# Altium project DC_CDI_Honda_CX500_rev2.2.PrjPcb
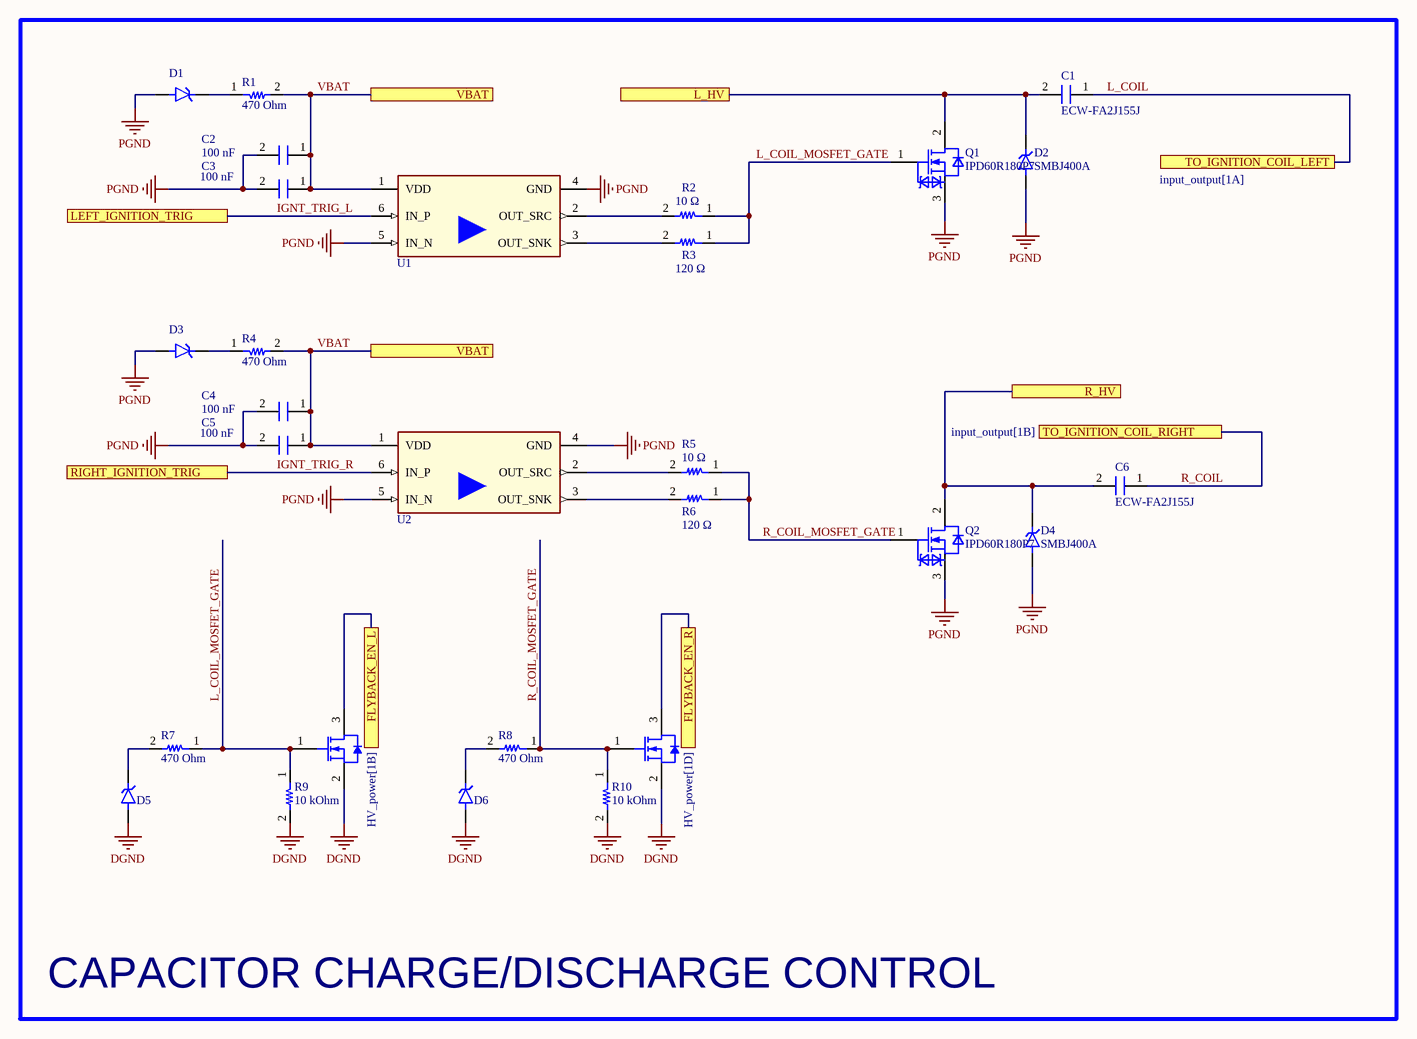
[diagram p0: cd_switching.SchDoc]
4 sheets, 131 parts. Net scope: flat (ports and power ports of the same name join across sheets).
Board file: dc_cdi_cx500.PcbDoc
Sheets:
  cd_switching.SchDoc
  input_output.SchDoc
  logic.SchDoc
  HV_power.SchDoc

## Sheet cd_switching.SchDoc: Power Side
size A3; SheetNumber: 1; SheetTotal: 6

### Parts
C1  ECW-FA2J155J  [22,5mm_CAP]
C2  value 100 nF  [0603_FP]  (hidden comment: Capacitor_0603)
C3  value 100 nF  [0603_FP]  (hidden comment: Capacitor_0603)
C4  value 100 nF  [0603_FP]  (hidden comment: Capacitor_0603)
C5  value 100 nF  [0603_FP]  (hidden comment: Capacitor_0603)
C6  ECW-FA2J155J  [22,5mm_CAP]
D1  BZT52B15SH_RRG  [DIO_BZT52B15SH_RRG]  (value not drawn)
D2  SMBJ400A  [DIOM5436X261N]
D3  BZT52B15SH_RRG  [DIO_BZT52B15SH_RRG]  (value not drawn)
D4  SMBJ400A  [DIOM5436X261N]
D5  BZT52B15SH_RRG  [DIO_BZT52B15SH_RRG]  (value not drawn)
D6  BZT52B15SH_RRG  [DIO_BZT52B15SH_RRG]  (value not drawn)
Q1  IPD60R180P7  [DPAK228P987X240-3N]
Q2  IPD60R180P7  [DPAK228P987X240-3N]
Q3  MGSF1N03LT1G  [ONSC-SOT-23-3-318-08_V]  (value not drawn)
Q4  MGSF1N03LT1G  [ONSC-SOT-23-3-318-08_V]  (value not drawn)
R1  value 470 Ohm  [0603_FP]  (hidden comment: Resistor_0603)
R2  value 10 Ω  [0603_FP]  (hidden comment: Resistor_0603)
R3  value 120 Ω  [0603_FP]  (hidden comment: Resistor_0603)
R4  value 470 Ohm  [0603_FP]  (hidden comment: Resistor_0603)
R5  value 10 Ω  [0603_FP]  (hidden comment: Resistor_0603)
R6  value 120 Ω  [0603_FP]  (hidden comment: Resistor_0603)
R7  value 470 Ohm  [0603_FP]  (hidden comment: Resistor_0603)
R8  value 470 Ohm  [0603_FP]  (hidden comment: Resistor_0603)
R9  value 10 kOhm  [0402_fp]  (hidden comment: Resistor_0402)
R10  value 10 kOhm  [0402_fp]  (hidden comment: Resistor_0402)
U1  1EDN7511B  [SOT95P280X145-6N-7-V]  (value not drawn)
U2  1EDN7511B  [SOT95P280X145-6N-7-V]  (value not drawn)

### Blocks framed on the sheet
CAPACITOR CHARGE/DISCHARGE CONTROL: C1-C6 D1-D6 Q1-Q4 R1-R10 U1 U2

### Ports
FLYBACK_EN_L (see HV_power[1B]), FLYBACK_EN_R (see HV_power[1D]), L_HV (see HV_power[4A]), LEFT_IGNITION_TRIG (see logic[1A]), R_HV (see HV_power[4B]), RIGHT_IGNITION_TRIG (see logic[1B]), TO_IGNITION_COIL_LEFT (see input_output[1A]), TO_IGNITION_COIL_RIGHT (see input_output[1B]), VBAT (see cd_switching[3A], HV_power[1A], HV_power[1C], input_output[2D], LV_power[1B]), VBAT (see cd_switching[3B], HV_power[1A], HV_power[1C], input_output[2D], LV_power[1B])

### Nets
DGND: D5.2(A) D6.2(A) Q3.2(S) Q4.2(S) R9.2 R10.2
PGND: C2.2 C3.2 C4.2 C5.2 D1.2(A) D2.2(A) D3.2(A) D4.2(A) Q1.3(SOURCE) Q2.3(SOURCE) U1.4(GND) U1.5(IN_N) U2.4(GND) U2.5(IN_N)
FLYBACK_EN_L: Q3.3(D) ; port FLYBACK_EN_L
FLYBACK_EN_R: Q4.3(D) ; port FLYBACK_EN_R
IGNT_TRIG_L: U1.6(IN_P) ; port LEFT_IGNITION_TRIG
IGNT_TRIG_R: U2.6(IN_P) ; port RIGHT_IGNITION_TRIG
L_COIL: C1.1 ; port TO_IGNITION_COIL_LEFT
L_COIL_MOSFET_GATE: Q1.1(GATE) Q3.1(G) R2.1 R3.1 R7.1 R9.1
L_HV: C1.2 D2.1(K) Q1.2(DRAIN) ; port L_HV
R_COIL: C6.1 ; port TO_IGNITION_COIL_RIGHT
R_COIL_MOSFET_GATE: Q2.1(GATE) Q4.1(G) R5.1 R6.1 R8.1 R10.1
R_HV: C6.2 D4.1(K) Q2.2(DRAIN) ; port R_HV
VBAT: C2.1 C3.1 C4.1 C5.1 R1.2 R4.2 U1.1(VDD) U2.1(VDD) ; port VBAT
NetD1_1: D1.1(K) R1.1
NetD3_1: D3.1(K) R4.1
NetD5_1: D5.1(K) R7.2
NetD6_1: D6.1(K) R8.2
NetR2_2: R2.2 U1.2(OUT_SRC)
NetR3_2: R3.2 U1.3(OUT_SNK)
NetR5_2: R5.2 U2.2(OUT_SRC)
NetR6_2: R6.2 U2.3(OUT_SNK)

### Library data of the parts
C1 C6 = Capacitor_THT_22.5mm
C2-C5 = Capacitor_0603: Format: 0402; Package: 0402
D1 D3 D5 D6 = BZT52B15SH_RRG: SOD-323, 200mW, 2%, 15V, Zener Diode; MF: Taiwan Semiconductor Corporation; MP: BZT52B15SH RRG; SnapEDA_Link: https://www.snapeda.com/parts/BZT52B15SH%20RRG/Taiwan+Semiconductor+Corporation/view-part/?ref=snap; Package: SOD-323-2 Taiwan Semiconductor; Value: *; Check_prices: https://www.snapeda.com/parts/BZT52B15SH%20RRG/Taiwan+Semiconductor+Corporation/view-part/?ref=eda
D2 D4 = SMBJ400A: Pince 648V 900mA Ipp TVS Diode Surface Mount DO-214AA (SMBJ); MF: Littelfuse; SnapEDA_Link: https://www.snapeda.com/parts/SMBJ400A/Littelfuse/view-part/?ref=snap; Package: DO-214 Littelfuse; Value: *; MP: SMBJ400A; Check_prices: https://www.snapeda.com/parts/SMBJ400A/Littelfuse/view-part/?ref=eda
Q1 Q2 = IPD60R180P7: Insulated-Gate Field-Effect Transistor (IGFET), N-Channel, Enhancement, Body Diode, ESD Diode Gate/Source, Pin 1 Gate, 2 Drain, 3 Source, 3 Pins; Manufacturer: Infineon Technologies; PackageReference: PG-TO252-3-342; Manufacturer Order Number: IPD60R180P7
Q3 Q4 = CMP-1058-00778-1: Power MOSFET, 30 V, 2.1 A, Single N-Channel, 3-Pin SOT-23, Pb-Free, Tape and Reel; Manufacturer: On Semiconductor; VGS(th) Max (V): 2.4; Channel Polarity: N Channel; Ciss Typ (pF): 140; Crss Typ (pF): 40; Coss Typ (pF): 100; V(BR)DSS Min (V): 30; ID Max (A): 2.1; VGS Max (V): 20; ComponentLink1Description: Manufacturer URL; PartNumber: MGSF1N03LT1G; Packing: Tape and Reel; DatasheetVersion: Rev. 10; ComponentLink1URL: http://www.onsemi.com/; Mounting Technology: Surface Mount; PackageVersion: Rev. AP, 11/2009; PackageDescription: 3-Pin Small Outline Transistor, Body 2.92 x 1.3 mm, Pitch 0.95 mm; Package Type: SOT-23-3; ComponentLink3URL: http://www.onsemi.cn/pub_link/Collateral/318-08.PDF; RoHS: Pb-Free; ComponentLink3Description: Package Specification; ComponentLink2Description: Datasheet; Configuration: Single; PackageReference: SOT-23-3-318-08; ComponentLink2URL: http://www.onsemi.cn/pub_link/Collateral/MGSF1N03LT1-D.PDF
R1-R8 = Resistor_0603: Format: 0402; Package: 0402
R9 R10 = Resistor_0402: Format: 0402; Package: 0402
U1 U2 = 1EDN7511B: EiceDRIVER, Fast Single Channel 4A/8A Low-Side Gate Driver, UVLO - 4.2V; Manufacturer: Infineon Technologies; ManufacturerPartNumber: 1EDN7511B; PackageReference: PG-SOT23-6-2

## Sheet input_output.SchDoc
size A4; SheetNumber: 2; SheetTotal: 6
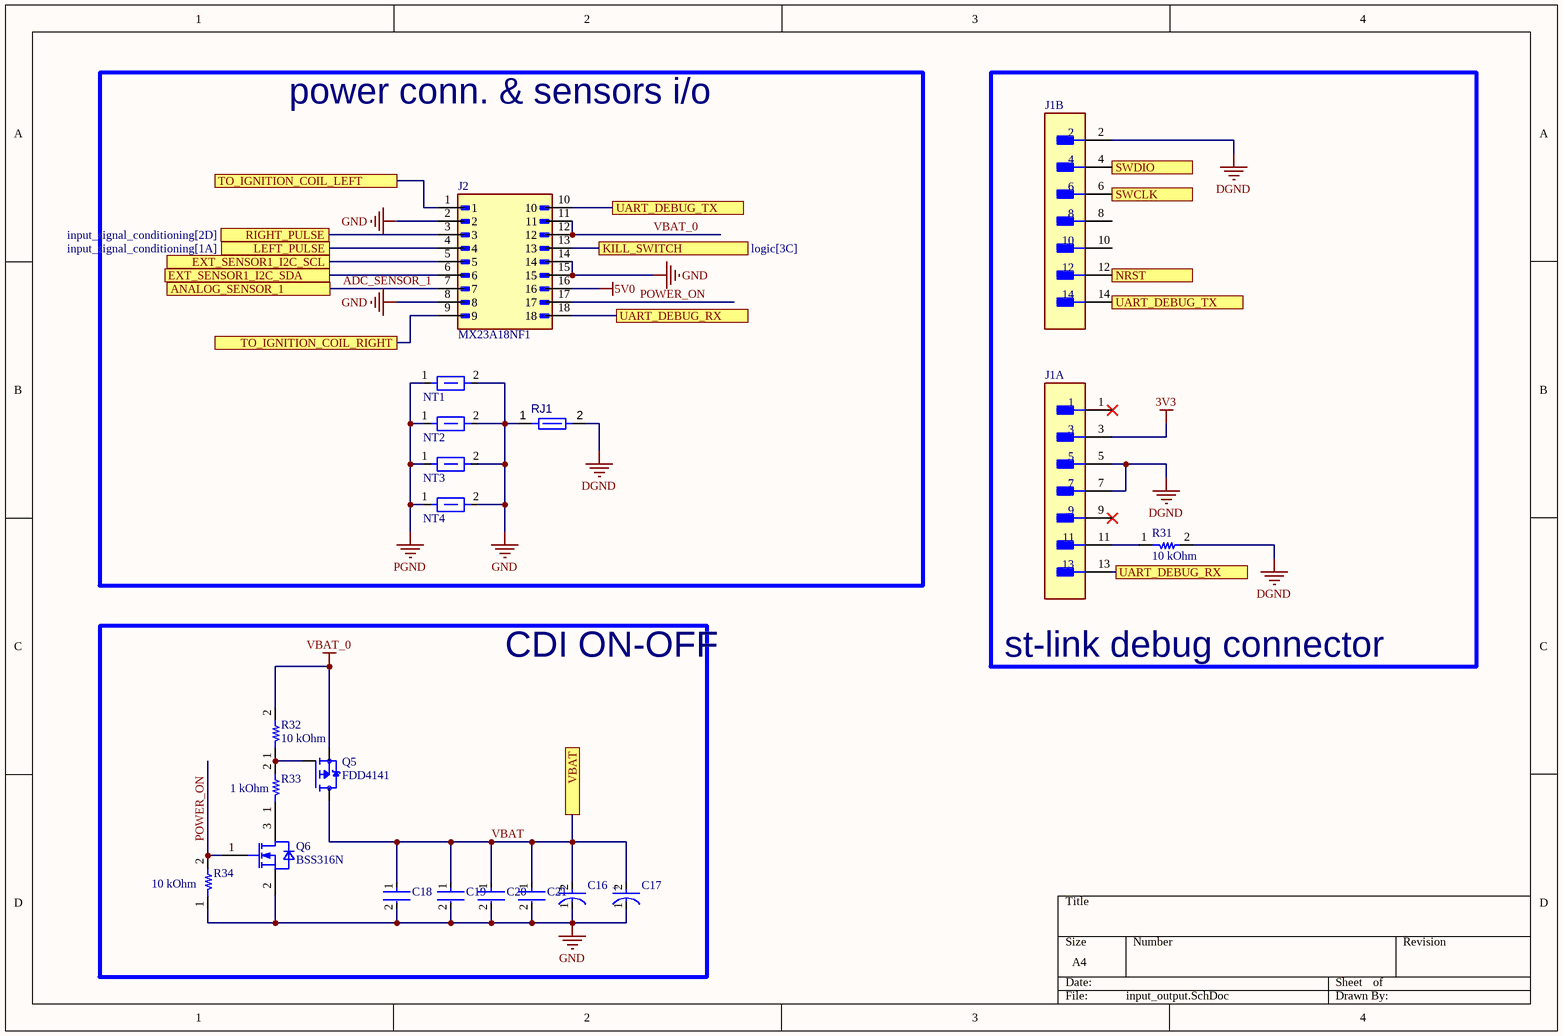
[diagram p1: input_output.SchDoc]

### Parts
C16  EEHZT1E221P  [FP-EEH-F-MFG]  (value not drawn)
C17  EEHZT1E221P  [FP-EEH-F-MFG]  (value not drawn)
C18  C1206X104J3GACTU  [FP-C1206X104J3GACTU-MFG]  (value not drawn)
C19  C1206X104J3GACTU  [FP-C1206X104J3GACTU-MFG]  (value not drawn)
C20  C1206X104J3GACTU  [FP-C1206X104J3GACTU-MFG]  (value not drawn)
C21  C1206X104J3GACTU  [FP-C1206X104J3GACTU-MFG]  (value not drawn)
J1  FTSH-107-01-F-DV-K  [FP-FTSH-107-01-F-DV-K-MFG]  (value not drawn)  (parts A,B of 2)
J2  MX23A18NF1  [JAE_MX23A18NF1]
NT1  GROUND_NET_TIE  [NET_TIE_GND]  (value not drawn)  (net tie, no BOM)
NT2  GROUND_NET_TIE  [NET_TIE_GND]  (value not drawn)  (net tie, no BOM)
NT3  GROUND_NET_TIE  [NET_TIE_GND]  (value not drawn)  (net tie, no BOM)
NT4  GROUND_NET_TIE  [NET_TIE_GND]  (value not drawn)  (net tie, no BOM)
Q5  FDD4141  [TO252]
Q6  BSS316N  [SOT95P260X110-3N]
R31  value 10 kOhm  [0603_FP]  (hidden comment: Resistor_0603)
R32  value 10 kOhm  [0603_FP]  (hidden comment: Resistor_0603)
R33  value 1 kOhm  [0603_FP]  (hidden comment: Resistor_0603)
R34  value 10 kOhm  [0603_FP]  (hidden comment: Resistor_0603)
RJ1  Net Tie 12x8mil  [SHORT06-FP]  (value not drawn)  (net tie, no BOM)

### Blocks framed on the sheet
power conn. & sensors i/o: J2 NT1-NT4 RJ1
st-link debug connector: J1 R31
CDI ON-OFF: C16-C21 Q5 Q6 R32-R34

### Ports
ANALOG_SENSOR_1 (see logic[1A]), EXT_SENSOR1_I2C_SCL (see logic[3A]), EXT_SENSOR1_I2C_SDA (see logic[3A]), KILL_SWITCH (see logic[3C]), LEFT_PULSE (see input_signal_conditioning[1A]), NRST (see logic[3B]), RIGHT_PULSE (see input_signal_conditioning[2D]), SWCLK (see logic[1B]), SWDIO (see logic[1B]), TO_IGNITION_COIL_LEFT (see cd_switching[6B]), TO_IGNITION_COIL_RIGHT (see cd_switching[6B]), UART_DEBUG_RX (see input_output[2B], logic[1B]), UART_DEBUG_RX (see input_output[3C], logic[1B]), UART_DEBUG_TX (see input_output[2A], logic[1B]), UART_DEBUG_TX (see input_output[3B], logic[1B]), VBAT (see cd_switching[3A], cd_switching[3B], HV_power[1A], HV_power[1C], LV_power[1B])

### Nets
3V3: J1.3
5V0: J2.16
DGND: J1.2 J1.5 J1.7 R31.2 RJ1.2
GND: C16.1(C) C17.1(C) C18.2 C19.2 C20.2 C21.2 J2.2 J2.8 J2.14 J2.15 NT1.2 NT2.2 NT3.2 NT4.2 Q6.2(SOURCE) R34.1 RJ1.1
PGND: NT1.1 NT2.1 NT3.1 NT4.1
VBAT_0: J2.11 J2.12 Q5.2(S) R32.2
ADC_SENSOR_1: J2.7 ; port ANALOG_SENSOR_1
EXT_SENSOR1_I2C_SCL: J2.5 ; port EXT_SENSOR1_I2C_SCL
EXT_SENSOR1_I2C_SDA: J2.6 ; port EXT_SENSOR1_I2C_SDA
KILL_SWITCH: J2.13 ; port KILL_SWITCH
L_COIL: J2.1 ; port TO_IGNITION_COIL_LEFT
NRST: J1.12 ; port NRST
POWER_ON: J2.17 Q6.1(GATE) R34.2
R_COIL: J2.9 ; port TO_IGNITION_COIL_RIGHT
SWCLK: J1.6 ; port SWCLK
SWDIO: J1.4 ; port SWDIO
UART_DEBUG_RX: J1.13 J2.18 ; port UART_DEBUG_RX
UART_DEBUG_TX: J1.14 J2.10 ; port UART_DEBUG_TX
VBAT: C16.2(A) C17.2(A) C18.1 C19.1 C20.1 C21.1 Q5.3(D) ; port VBAT
NetJ1_11: J1.11 R31.1
NetJ2_3: J2.3 ; port RIGHT_PULSE
NetJ2_4: J2.4 ; port LEFT_PULSE
NetQ5_1: Q5.1(G) R32.1 R33.2
NetQ6_3: Q6.3(DRAIN) R33.1

Not connected (* = marked no-connect by the designer): J1 1* 8 9* 10

### Notes on the sheet
- (in symbol CMP-05428-000892-1) +

### Library data of the parts
C16 C17 = CMP-05428-000892-1: Conductive Polymer Hybrid Aluminum Electrolytic Capacitors 220uF ±20% 25V RADIAL SMT 8x10.2mm
C18-C21 = CMP-03020-034648-1: CAP CER 0.1UF 25V C0G/NP0 1206; RoHS Compliant: Yes
J1 = CMP-02766-001448-1: CONN HEADER SMD 14POS 1.27MM; Gender: Male; Connector Type: Male Pin; Number of Contacts: 14; Row Spacing: 0.05inch; Min Operating Temperature: -55°C; Package Quantity: 1; Lead Free: Lead Free; RoHS Compliant: Yes; Contact Material: Bronze; Contact Plating: Gold; Number of Rows: 2; Housing Material: Polymer; Contact Type: Male Pin; Series: FTSH; Max Operating Temperature: 125°C; Orientation: Straight; Number of Positions: 14; Pitch: 1.27mm; Housing Color: Black; Color: Black; Radiation Hardening: No; Length: 8.89mm; Termination: Solder; Packaging: Rail/Tube; Depth: 5.84mm; Mount: Surface Mount; Contact Mating Length: 0.12inch
J2 = MX23A18NF1: MF: JAE Electronics; SnapEDA_Link: https://www.snapeda.com/parts/MX23A18NF1/JAE+Electronics/view-part/?ref=snap; Package: None; Value: *; MP: MX23A18NF1; Check_prices: https://www.snapeda.com/parts/MX23A18NF1/JAE+Electronics/view-part/?ref=eda
Q5 = FDD4141: P-Channel 40V 10.8A (Ta), 50A (Tc) 2.4W (Ta), 69W (Tc) Surface Mount D-PAK (TO-252AA); MF: onsemi; SnapEDA_Link: https://www.snapeda.com/parts/FDD4141/Onsemi/view-part/?ref=snap; Package: TO-252-3 ON Semiconductor; Value: *; MP: FDD4141; Check_prices: https://www.snapeda.com/parts/FDD4141/Onsemi/view-part/?ref=eda
Q6 = BSS316N: Insulated-Gate Field-Effect Transistor (IGFET), N-Channel, Enhancement, Body Diode, Pin 1 Gate, 2 Source, 3 Drain, 3 Pins; Manufacturer: Infineon Technologies; ManufacturerPartNumber: BSS316N; PackageReference: PG-SOT23-3-5
R31-R34 = Resistor_0603: Format: 0402; Package: 0402
RJ1 = CMP-009-00121-2: Max Operating Temperature: 155°C; Pins: 2; Min Operating Temperature: -55°C

## Sheet logic.SchDoc
size A4; SheetNumber: 4; SheetTotal: 6
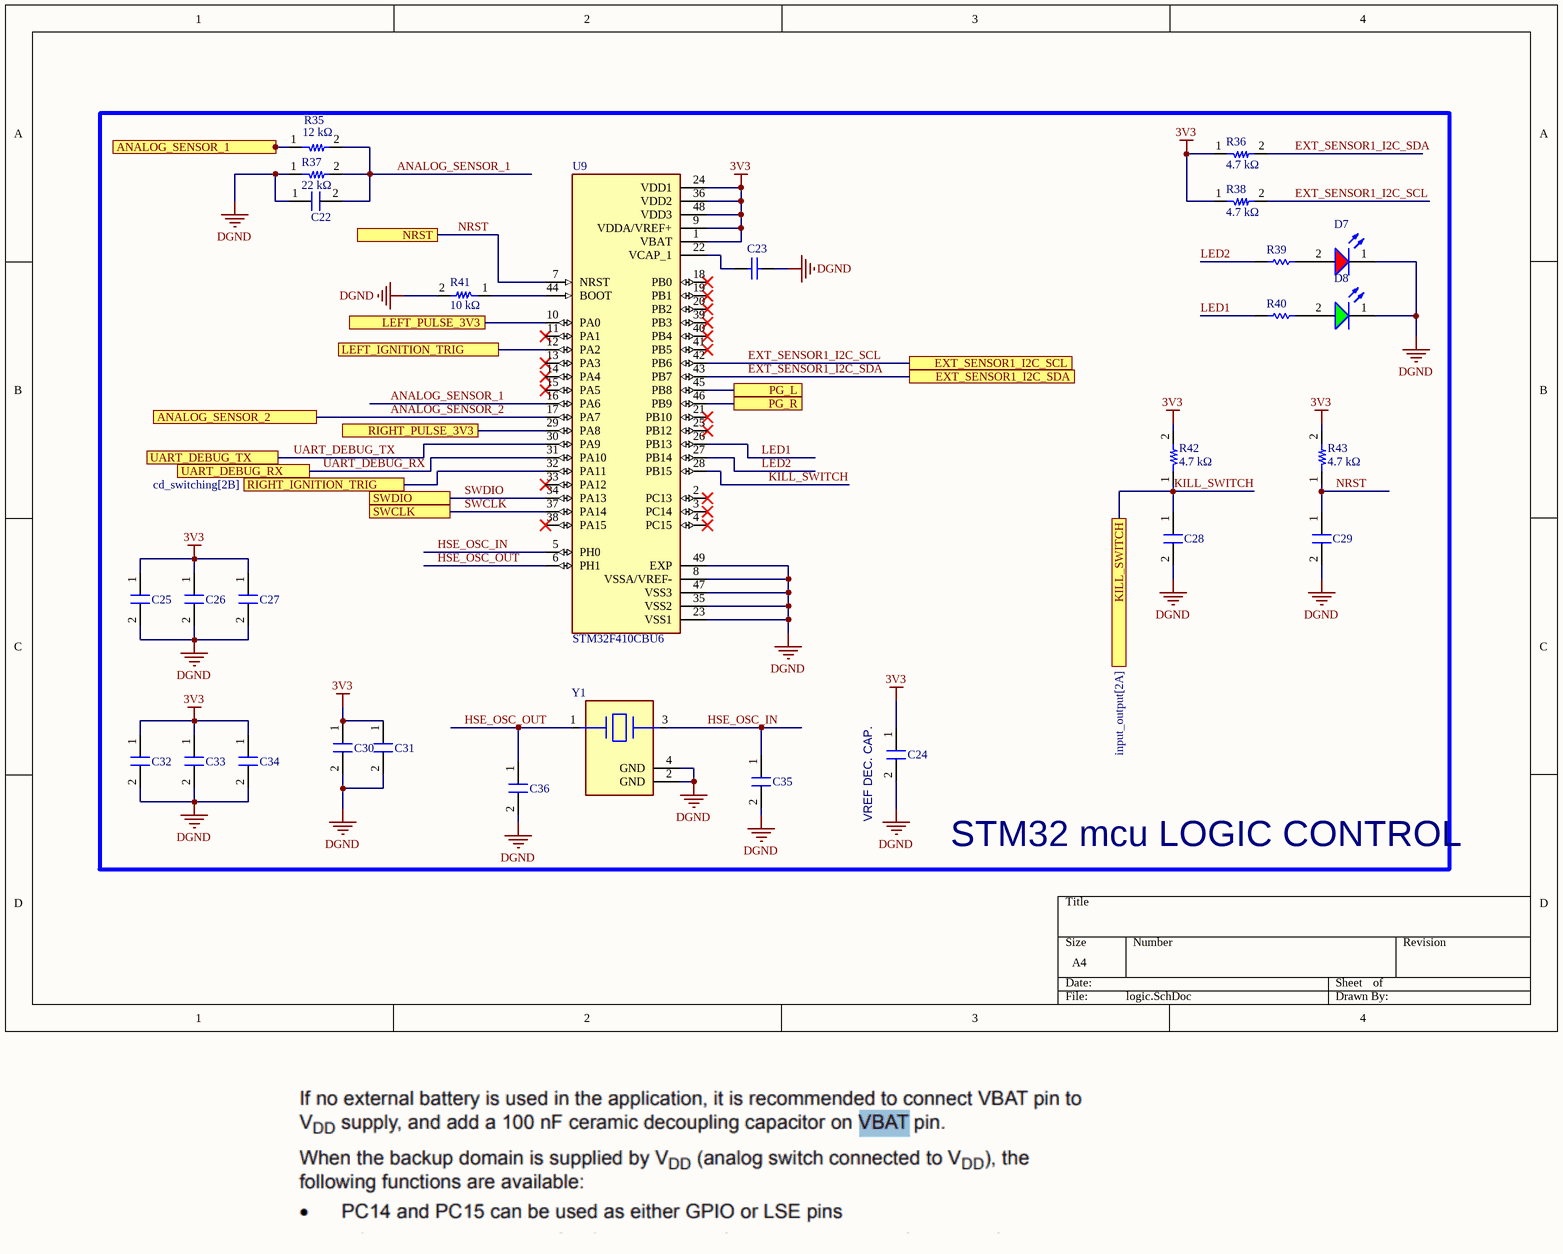
[diagram p2: logic.SchDoc]

### Parts
C22  Capacitor_0402  [0402_fp]  (value not drawn)
C23  0603ZD475MAT2A  [CAPC1608X90X35NL15T15]  (value not drawn)
C24  Capacitor_0402  [0402_fp]  (value not drawn)
C25  Capacitor_0402  [0402_fp]  (value not drawn)
C26  Capacitor_0402  [0402_fp]  (value not drawn)
C27  Capacitor_0402  [0402_fp]  (value not drawn)
C28  Capacitor_0402  [0402_fp]  (value not drawn)
C29  Capacitor_0402  [0402_fp]  (value not drawn)
C30  Capacitor_0402  [0402_fp]  (value not drawn)
C31  Capacitor_0402  [0402_fp]  (value not drawn)
C32  Capacitor_0402  [0402_fp]  (value not drawn)
C33  Capacitor_0402  [0402_fp]  (value not drawn)
C34  Capacitor_0402  [0402_fp]  (value not drawn)
C35  Capacitor_0603  [0603_FP]  (value not drawn)
C36  Capacitor_0603  [0603_FP]  (value not drawn)
D7  150080RS75000  [WL-SMCW_0805_150080xx75000]  (value not drawn)
D8  150080GS75000  [WL-SMCW_0805_150080xx75000]  (value not drawn)
R35  value 12 kΩ  [0402_fp]  (hidden comment: Resistor_0402)
R36  value 4.7 kΩ  [0402_fp]  (hidden comment: Resistor_0402)
R37  value 22 kΩ  [0402_fp]  (hidden comment: Resistor_0402)
R38  value 4.7 kΩ  [0402_fp]  (hidden comment: Resistor_0402)
R39  MCS04020D5600BE100  [RESC1005X37X20NL05T10]  (value not drawn)
R40  MCS04020D5600BE100  [RESC1005X37X20NL05T10]  (value not drawn)
R41  value 10 kΩ  [0402_fp]  (hidden comment: Resistor_0402)
R42  value 4.7 kΩ  [0402_fp]  (hidden comment: Resistor_0402)
R43  value 4.7 kΩ  [0402_fp]  (hidden comment: Resistor_0402)
U9  STM32F410CBU6  [QFN50P700X700X60-49N]
Y1  NX3225GA-16.000M-STD-CRG-2  [FP-NX3225GA-MFG]  (value not drawn)

### Ports
ANALOG_SENSOR_1 (see input_output[1B]), ANALOG_SENSOR_2, EXT_SENSOR1_I2C_SCL (see input_output[1B]), EXT_SENSOR1_I2C_SDA (see input_output[1B]), KILL_SWITCH (see input_output[2A]), LEFT_IGNITION_TRIG (see cd_switching[2B]), LEFT_PULSE_3V3 (see input_signal_conditioning[4B]), NRST (see input_output[3B]), PG_L (see HV_power[4B]), PG_R (see HV_power[4C]), RIGHT_IGNITION_TRIG (see cd_switching[2B]), RIGHT_PULSE_3V3 (see input_signal_conditioning[4B]), SWCLK (see input_output[3A]), SWDIO (see input_output[3A]), UART_DEBUG_RX (see input_output[2B], input_output[3C]), UART_DEBUG_TX (see input_output[2A], input_output[3B])

### Nets
3V3: C24.1 C25.1 C26.1 C27.1 C30.1 C31.1 C32.1 C33.1 C34.1 R36.1 R38.1 R42.2 R43.2 U9.1(VBAT) U9.9(VDDA/VREF+) U9.24(VDD1) U9.36(VDD2) U9.48(VDD3)
DGND: C22.1 C23.2 C24.2 C25.2 C26.2 C27.2 C28.2 C29.2 C30.2 C31.2 C32.2 C33.2 C34.2 C35.2 C36.2 D7.1(K) D8.1(K) R37.1 R41.2 U9.8(VSSA/VREF-) U9.23(VSS1) U9.35(VSS2) U9.47(VSS3) U9.49(EXP) Y1.2(GND) Y1.4(GND)
ADC_SENSOR_1: R35.1 ; port ANALOG_SENSOR_1
ANALOG_SENSOR_1: C22.2 R35.2 R37.2 U9.16(PA6)
ANALOG_SENSOR_2: U9.17(PA7) ; port ANALOG_SENSOR_2
EXT_SENSOR1_I2C_SCL: R38.2 U9.42(PB6) ; port EXT_SENSOR1_I2C_SCL
EXT_SENSOR1_I2C_SDA: R36.2 U9.43(PB7) ; port EXT_SENSOR1_I2C_SDA
HSE_OSC_IN: C35.1 U9.5(PH0) Y1.3
HSE_OSC_OUT: C36.1 U9.6(PH1) Y1.1
IGNT_TRIG_L: U9.12(PA2) ; port LEFT_IGNITION_TRIG
IGNT_TRIG_R: U9.32(PA11) ; port RIGHT_IGNITION_TRIG
KILL_SWITCH: C28.1 R42.1 U9.28(PB15) ; port KILL_SWITCH
LED1: R40.1 U9.26(PB13)
LED2: R39.1 U9.27(PB14)
NRST: C29.1 R43.1 U9.7(NRST) ; port NRST
SWCLK: U9.37(PA14) ; port SWCLK
SWDIO: U9.34(PA13) ; port SWDIO
UART_DEBUG_RX: U9.31(PA10) ; port UART_DEBUG_RX
UART_DEBUG_TX: U9.30(PA9) ; port UART_DEBUG_TX
NetC23_1: C23.1 U9.22(VCAP_1)
NetD7_2: D7.2(A) R39.2
NetD8_2: D8.2(A) R40.2
NetD11_1: U9.45(PB8) ; port PG_L
NetD14_1: U9.46(PB9) ; port PG_R
NetR41_1: R41.1 U9.44(BOOT)
NetU9_10: U9.10(PA0) ; port LEFT_PULSE_3V3
NetU9_29: U9.29(PA8) ; port RIGHT_PULSE_3V3

Not connected (* = marked no-connect by the designer): U9 2(PC13)* 3(PC14)* 4(PC15)* 11(PA1)* 13(PA3)* 14(PA4)* 15(PA5)* 18(PB0)* 19(PB1)* 20(PB2)* 21(PB10)* 25(PB12)* 33(PA12)* 38(PA15)* 39(PB3)* 40(PB4)* 41(PB5)*

### Notes on the sheet
- (near C24) VREF DEC. CAP.
- STM32 mcu LOGIC CONTROL

### Library data of the parts
C22 = Capacitor_0402: Value: 1 nF; Format: 0402; Package: 0402
C23 = CMP-1035-02787-2: Manufacturer: AVX Interconnect / Elco; Part Number: 0603ZD475MAT2A
C24 C28 C29 = Capacitor_0402: Value: 100 nF; Format: 0402; Package: 0402
C25-C27 C30-C34 = Capacitor_0402: Value: 10 nF; Format: 0402; Package: 0402
C35 C36 = Capacitor_0603: Value: 10 pF; Format: 0402; Package: 0402
D7 = CMP-1426-00011-3: LED Uni-Color Red 630nm 2-Pin Chip 0805(2012Metric) T/R; Viewing Angle: 140°; Max Junction Temperature (Tj): 95°C; Power Dissipation: 72mW; Forward Current: 100mA; Forward Voltage: 2V; Wavelength: 625nm; Test Current: 20mA; Max Reverse Voltage (DC): 5V; Luminous Intensity: 150mcd; Lens Style: Clear, Rectangular; REACH SVHC: Unknown; Height: 700µm; Case Code (Metric): 2012; Peak Wavelength: 630nm; Length: 2mm; Width: 1.25mm; RoHS: Compliant; Packaging: Tape and Reel; Dominant Wavelength: 625nm; Color: Red; Case Code (Imperial): 0805; Min Operating Temperature: -40°C; Mount: Surface Mount; Max Operating Temperature: 85°C; Case/Package: 0805
D8 = CMP-1426-00007-3: WURTH ELEKTRONIK - 150080GS75000 - LED, Green, SMD, 0805, 30 mA, 3.2 V, 520 nm; Forward Voltage: 3.2V; Viewing Angle: 140°; Power Dissipation: 105mW; Peak Wavelength: 515nm; Max Reverse Voltage (DC): 5V; Luminous Intensity: 450mcd; Wavelength: 525nm; Max Junction Temperature (Tj): 95°C; Forward Current: 100mA; Test Current: 20mA; Lens Style: Clear, Rectangular; Length: 2mm; Case/Package: 0805; Case Code (Metric): 2012; Color: Green; Height: 700µm; Width: 1.25mm; Packaging: Tape and Reel; Mount: Surface Mount; REACH SVHC: Unknown; RoHS: Compliant; Min Operating Temperature: -40°C; Reverse Voltage: 5V; Max Operating Temperature: 85°C; Dominant Wavelength: 525nm; Case Code (Imperial): 0805
R39 R40 = CMP-2002-02518-1: Manufacturer: Vishay BCcomponents; Part Number: MCS04020D5600BE100
U9 = STM32F410CBU6: ARMÂ® CortexÂ®-M4 STM32F4 Microcontroller IC 32-Bit Single-Core 100MHz 128KB (128K x 8) FLASH 48-UFQFPN (7x7); MF: STMicroelectronics; SnapEDA_Link: https://www.snapeda.com/parts/STM32F410CBU6/STMicroelectronics/view-part/?ref=snap; Package: UFQFPN-48 STMicroelectronics; Value: *; MP: STM32F410CBU6; Check_prices: https://www.snapeda.com/parts/STM32F410CBU6/STMicroelectronics/view-part/?ref=eda
Y1 = CMP-200220-000007-1: CRYSTAL 16.0000MHZ 8PF SMD; Frequency Stability: 30ppm; Frequency Tolerance: 20ppm; Frequency: 16MHz; ESR (Equivalent Series Resistance): 80R; Min Operating Temperature: -40°C; Mount: Surface Mount; Width: 0.098inch; Case/Package: SMD/SMT; Max Operating Temperature: 85°C; Number of Pins: 4; Length: 0.126inch; Load Capacitance: 8pF; Packaging: Tape and Reel; Package Quantity: 3000; Height: 0.035inch
R35-R38 R41-R43 = Resistor_0402: Package: 0402

## Sheet HV_power.SchDoc
size A4; SheetNumber: 5; SheetTotal: 6
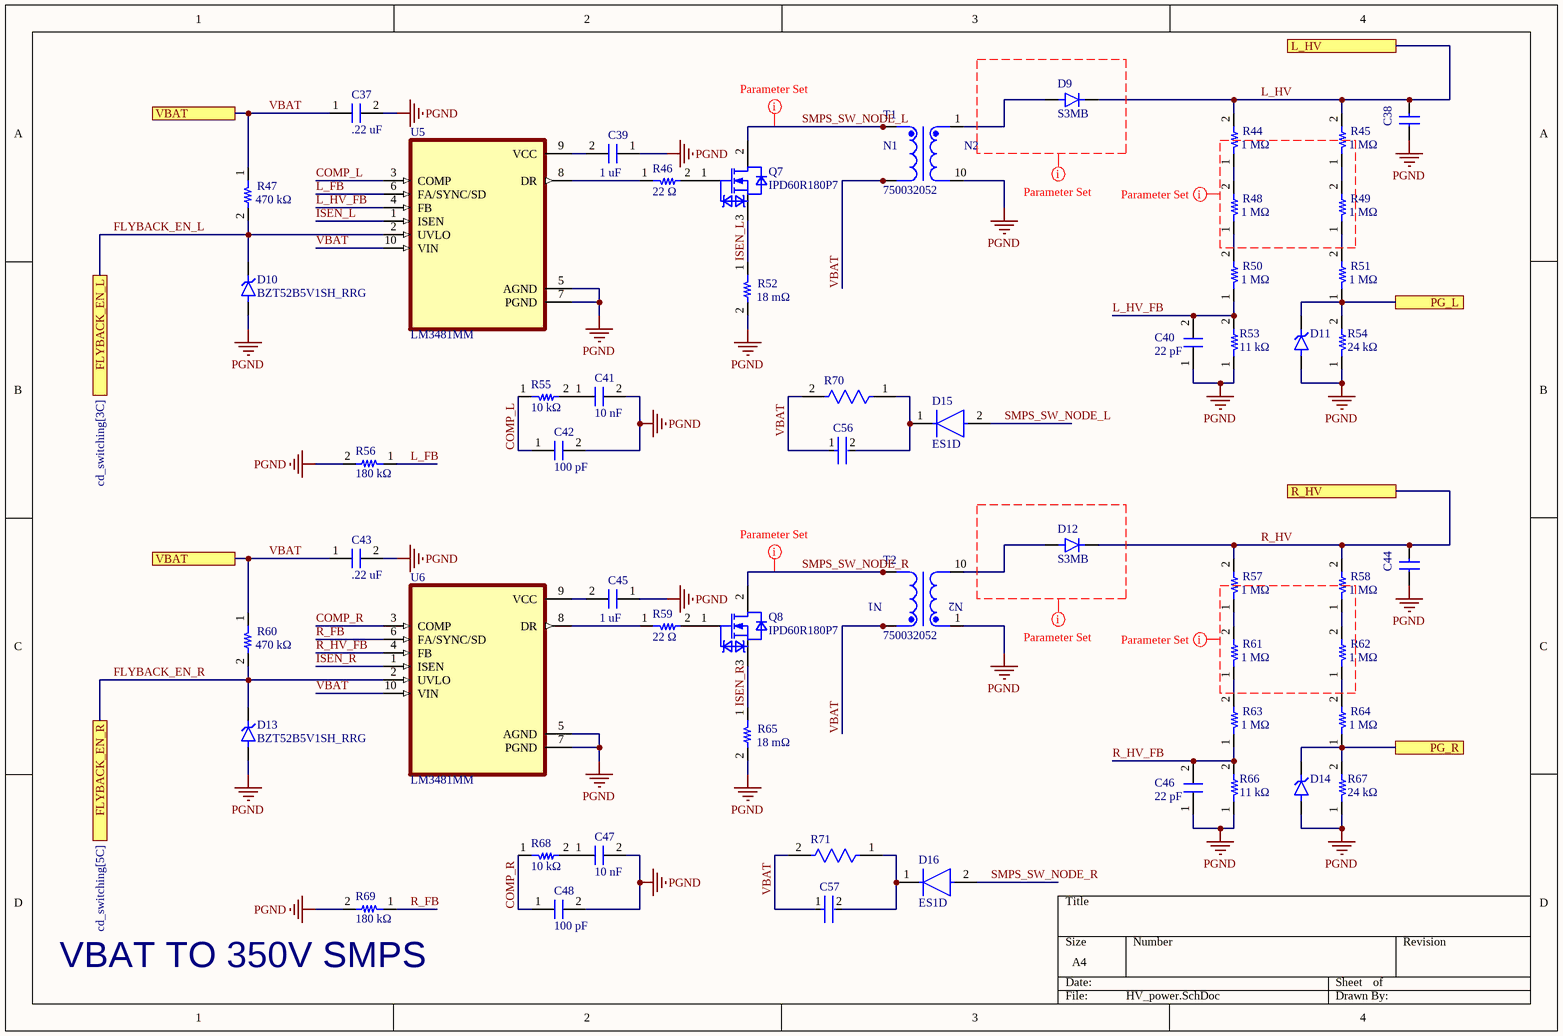
[diagram p3: HV_power.SchDoc]

### Parts
C37  value .22 uF  [0603_FP]  (hidden comment: GRM21BR61C475KA88L)
C38  WCAP-FTBP_P10  [WCAP-FTBP_10X13X5.5X11(PXLXWXH)]  (value not drawn)
C39  value 1 uF  [0603_FP]  (hidden comment: Capacitor_0603)
C40  value 22 pF  [0603_FP]  (hidden comment: Capacitor_0603)
C41  value 10 nF  [0603_FP]  (hidden comment: Capacitor_0603)
C42  value 100 pF  [0603_FP]  (hidden comment: Capacitor_0603)
C43  value .22 uF  [0603_FP]  (hidden comment: GRM21BR61C475KA88L)
C44  WCAP-FTBP_P10  [WCAP-FTBP_10X13X5.5X11(PXLXWXH)]  (value not drawn)
C45  value 1 uF  [0603_FP]  (hidden comment: Capacitor_0603)
C46  value 22 pF  [0603_FP]  (hidden comment: Capacitor_0603)
C47  value 10 nF  [0603_FP]  (hidden comment: Capacitor_0603)
C48  value 100 pF  [0603_FP]  (hidden comment: Capacitor_0603)
C56  C1206C683K1RACAUTO  [FP-C1206C-EB-MFG]  (value not drawn)
C57  C1206C683K1RACAUTO  [FP-C1206C-EB-MFG]  (value not drawn)
D9  S3MB  [DIOM4336X265N]
D10  BZT52B5V1SH_RRG  [DIO_BZT52B5V1SH_RRG]
D11  BZT52B15SH_RRG  [DIO_BZT52B15SH_RRG]  (value not drawn)
D12  S3MB  [DIOM4336X265N]
D13  BZT52B5V1SH_RRG  [DIO_BZT52B5V1SH_RRG]
D14  BZT52B15SH_RRG  [DIO_BZT52B15SH_RRG]  (value not drawn)
D15  ES1D  [FP-403AE-MFG]
D16  ES1D  [FP-403AE-MFG]
Q7  IPD60R180P7  [DPAK228P987X240-3N]
Q8  IPD60R180P7  [DPAK228P987X240-3N]
R44  value 1 MΩ  [0805_FP]  (hidden comment: R_0805)
R45  value 1 MΩ  [0805_FP]  (hidden comment: R_0805)
R46  value 22 Ω  [0603_FP]  (hidden comment: Resistor_0603)
R47  value 470 kΩ  [0603_FP]  (hidden comment: Resistor_0603)
R48  value 1 MΩ  [0805_FP]  (hidden comment: R_0805)
R49  value 1 MΩ  [0805_FP]  (hidden comment: R_0805)
R50  value 1 MΩ  [0805_FP]  (hidden comment: R_0805)
R51  value 1 MΩ  [0805_FP]  (hidden comment: R_0805)
R52  value 18 mΩ  [2010_FP]  (hidden comment: 2010_res)
R53  value 11 kΩ  [0805_FP]  (hidden comment: R_0805)
R54  value 24 kΩ  [0805_FP]  (hidden comment: R_0805)
R55  value 10 kΩ  [0603_FP]  (hidden comment: Resistor_0603)
R56  value 180 kΩ  [0603_FP]  (hidden comment: Resistor_0603)
R57  value 1 MΩ  [0805_FP]  (hidden comment: R_0805)
R58  value 1 MΩ  [0805_FP]  (hidden comment: R_0805)
R59  value 22 Ω  [0603_FP]  (hidden comment: Resistor_0603)
R60  value 470 kΩ  [0603_FP]  (hidden comment: Resistor_0603)
R61  value 1 MΩ  [0805_FP]  (hidden comment: R_0805)
R62  value 1 MΩ  [0805_FP]  (hidden comment: R_0805)
R63  value 1 MΩ  [0805_FP]  (hidden comment: R_0805)
R64  value 1 MΩ  [0805_FP]  (hidden comment: R_0805)
R65  value 18 mΩ  [2010_FP]  (hidden comment: 2010_res)
R66  value 11 kΩ  [0805_FP]  (hidden comment: R_0805)
R67  value 24 kΩ  [0805_FP]  (hidden comment: R_0805)
R68  value 10 kΩ  [0603_FP]  (hidden comment: Resistor_0603)
R69  value 180 kΩ  [0603_FP]  (hidden comment: Resistor_0603)
R70  CRCW25121K80FKEG  [FP-CRCW2512-e3-MFG]  (value not drawn)
R71  CRCW25121K80FKEG  [FP-CRCW2512-e3-MFG]  (value not drawn)
T1  750032052  [WE-FB3751_EFD20]
T2  750032052  [WE-FB3751_EFD20]
U5  LM3481MM  [SOP50P490X110-10N]
U6  LM3481MM  [SOP50P490X110-10N]

### Ports
FLYBACK_EN_L (see cd_switching[3C]), FLYBACK_EN_R (see cd_switching[5C]), L_HV (see cd_switching[4A]), PG_L (see logic[2B]), PG_R (see logic[2B]), R_HV (see cd_switching[6B]), VBAT (see cd_switching[3A], cd_switching[3B], HV_power[1A], input_output[2D], LV_power[1B]), VBAT (see cd_switching[3A], cd_switching[3B], HV_power[1C], input_output[2D], LV_power[1B])

### Nets
PGND: C37.2 C38.1 C39.1 C40.1 C41.2 C42.2 C43.2 C44.1 C45.1 C46.1 C47.2 C48.2 D10.2(A) D11.2(A) D13.2(A) D14.2(A) R52.2 R53.1 R54.1 R56.2 R65.2 R66.1 R67.1 R69.2 T1.10 T2.1 U5.5(AGND) U5.7(PGND) U6.5(AGND) U6.7(PGND)
COMP_L: C42.1 R55.1 U5.3(COMP)
COMP_R: C48.1 R68.1 U6.3(COMP)
FLYBACK_EN_L: D10.1(K) R47.2 U5.2(UVLO) ; port FLYBACK_EN_L
FLYBACK_EN_R: D13.1(K) R60.2 U6.2(UVLO) ; port FLYBACK_EN_R
ISEN_L: Q7.3(SOURCE) R52.1 U5.1(ISEN)
ISEN_R: Q8.3(SOURCE) R65.1 U6.1(ISEN)
L_FB: R56.1 U5.6(FA/SYNC/SD)
L_HV: C38.2 D9.C(K) R44.2 R45.2 ; port L_HV
L_HV_FB: C40.2 R50.1 R53.2 U5.4(FB)
R_FB: R69.1 U6.6(FA/SYNC/SD)
R_HV: C44.2 D12.C(K) R57.2 R58.2 ; port R_HV
R_HV_FB: C46.2 R63.1 R66.2 U6.4(FB)
SMPS_SW_NODE_L: D15.2(A) Q7.2(DRAIN) T1.6(6+7) T1.7(6+7)
SMPS_SW_NODE_R: D16.2(A) Q8.2(DRAIN) T2.4(4+5) T2.5(4+5)
VBAT: C37.1 C43.1 C56.1 C57.1 R47.1 R60.1 R70.2 R71.2 T1.4(4+5) T1.5(4+5) T2.6(6+7) T2.7(6+7) U5.10(VIN) U6.10(VIN) ; port VBAT
NetC39_2: C39.2 U5.9(VCC)
NetC41_1: C41.1 R55.2
NetC45_2: C45.2 U6.9(VCC)
NetC47_1: C47.1 R68.2
NetC56_2: C56.2 D15.1(C) R70.1
NetC57_2: C57.2 D16.1(C) R71.1
NetD9_A: D9.A T1.1
NetD11_1: D11.1(K) R51.1 R54.2 ; port PG_L
NetD12_A: D12.A T2.10
NetD14_1: D14.1(K) R64.1 R67.2 ; port PG_R
NetQ7_1: Q7.1(GATE) R46.2
NetQ8_1: Q8.1(GATE) R59.2
NetR44_1: R44.1 R48.2
NetR45_1: R45.1 R49.2
NetR46_1: R46.1 U5.8(DR)
NetR48_1: R48.1 R50.2
NetR49_1: R49.1 R51.2
NetR57_1: R57.1 R61.2
NetR58_1: R58.1 R62.2
NetR59_1: R59.1 U6.8(DR)
NetR61_1: R61.1 R63.2
NetR62_1: R62.1 R64.2

### Layout directives
net class HV_NETS: (no net found under the mark), SMPS_SW_NODE_L, SMPS_SW_NODE_R
net class FB_NETS: (no net found under the mark)

### Notes on the sheet
- (near R69) VBAT TO 350V SMPS
- (in symbol 750032052) N1; N2

### Library data of the parts
C37 C39-C43 C45-C48 = Capacitor_0603: Format: 0402; Package: 0402
C38 C44 = WCAP-FTBP_P10: MPPP010104J400DCPP55004; THT Boxed; 100 nF Â± 5 %; 400V (DC); RIso â‰¥ 30 GÎ©; pitch 10; Climate category 40/105/56; MF: Wurth Elektronik; MP: 890283323005CS; SnapEDA_Link: https://www.snapeda.com/parts/890283323005CS/Wurth+Electronics/view-part/?ref=snap; Package: None; Value: *; Check_prices: https://www.snapeda.com/parts/890283323005CS/Wurth+Electronics/view-part/?ref=eda
C56 C57 = CMP-03020-029357-1: C1206 68,000 pF X7R 10.00% 100 V; Manufacturer: KEMET; Automotive Grade: Grade 0; Tolerance: 0.1; Temperature Coefficient: 15%; Voltage Rating: 100 V; Material: Ceramic; Temperature Characteristic: X7R; ComponentLink2Description: Datasheet; Category: Cap; Temperature Range Low: -55°C; Device Class L3: Ceramic Capacitors; Octopart: https://octopart.com/c1206c683k1racauto-kemet-89187447; Ipc Land Pattern Name: CAPC320160X78; RoHS: TRUE; Lead Free: Yes; Manufacturer Part Number: C1206C683K1RACAUTO; Height: 0.88mm; Temperature: -55°C to +150°C; Automotive: Yes; ComponentLink2URL: https://content.kemet.com/datasheets/KEM_C1007_X8R_ULTRA_150C_SMD.pdf; Temperature Range High: +150°C; Device Class L1: Passive Components; Capacitance: 68,000 pF; Device Class L2: Capacitors; Package: C1206C-EB; Value: 68,000 pF
D9 D12 = S3MB: 3A, 1000V, Standard Recovery Rectifier; MF: Taiwan Semiconductor; SnapEDA_Link: https://www.snapeda.com/parts/S3MB/taiwan/view-part/?ref=snap; Package: SMD-2 Taiwan Semiconductor; Value: *; MP: S3MB; Check_prices: https://www.snapeda.com/parts/S3MB/taiwan/view-part/?ref=eda
D10 D13 = BZT52B5V1SH_RRG: SOD-323, 200mW, 2%, 5.1V, Zener Diode; MF: Taiwan Semiconductor Corporation; MP: BZT52B5V1SH RRG; SnapEDA_Link: https://www.snapeda.com/parts/BZT52B5V1SH%20RRG/Taiwan+Semiconductor+Corporation/view-part/?ref=snap; Package: SOD-323-2 Taiwan Semiconductor; Value: *; Check_prices: https://www.snapeda.com/parts/BZT52B5V1SH%20RRG/Taiwan+Semiconductor+Corporation/view-part/?ref=eda
D11 D14 = BZT52B15SH_RRG: as D1 on sheet cd_switching; SnapEDA_Link: https://www.snapeda.com/parts/BZT52B15SH%20RRG/Taiwan+Semiconductor+Corporation/view-part/?ref=snap; Package: SOD-323-2 Taiwan Semiconductor; Value: *; Check_prices: https://www.snapeda.com/parts/BZT52B15SH%20RRG/Taiwan+Semiconductor+Corporation/view-part/?ref=eda
D15 D16 = CMP-2000-06230-3: DIODE GEN PURP 200V 1A SMA; Manufacturer: ON Semi; Peak Reverse Current: 5uA; Description: Diode Switching 200V 1A 2-Pin SMA T/R; Value: 7pF; Max Surge Forward Current: 30A; Max Junction Temp: +150°C; Standoff Height: 0.05mm; Temperature Range High: +150°C; Footprint Url: http://www.onsemi.com/pub/Collateral/403AE.PDF; Category: Diode; Device Class L3: Rectifier Diodes; RoHS: TRUE; Package: 403AE; Temperature Range Low: -50°C; Lead Free: Yes; Device Class L1: Discrete Semiconductors; ComponentLink2Description: Datasheet; Device Class L2: Diodes; Capacitance: 7pF; Temperature: -50°C to +150°C; Manufacturer Part Number: ES1D; Automotive: No; Max Repetitive Reverse Voltage: 200V; Octopart: https://octopart.com/es1d-on+semiconductor-84324855; ComponentLink2URL: https://www.onsemi.jp/PowerSolutions/document/ES1D-D.PDF; Height: 2.5mm; Forward Current: 1A; Digikey Description: DIODE GEN PURP 200V 1A SMA
Q7 Q8 = IPD60R180P7: as Q1 on sheet cd_switching; PackageReference: PG-TO252-3-342; Manufacturer Order Number: IPD60R180P7
R46 R47 R55 R56 R59 R60 R68 R69 = Resistor_0603: Format: 0402; Package: 0402
R70 R71 = CMP-02407-001040-1: RES SMD 1.8K OHM 1% 1W 2512; Voltage Rating (DC): 500V; Resistance: 1.8kR; Power Rating: 1W; Length: 6.3mm; Depth: 3.15mm; Packaging: Tape and Reel; Tolerance: 1%; Composition: Thick Film; Military Standard: Not; Min Operating Temperature: -55°C; Case/Package: 2512; Lead Free: Lead Free; Max Operating Temperature: 155°C; Width: 3.15mm
T1 T2 = 750032052: L= 10ÂµH, Turns ratio 10:1; Iprim=10A; suitable for LT3750; Vin = 3-24V typ.; Vout = variable 300V typ.; fswitch = 100-400kHz; MF: Wurth Electronics; SnapEDA_Link: https://www.snapeda.com/parts/750032052/Wurth+Electronics/view-part/?ref=snap; Package: None; Value: *; MP: 750032052; Check_prices: https://www.snapeda.com/parts/750032052/Wurth+Electronics/view-part/?ref=eda
U5 U6 = LM3481MM: 2.97V to 48V High-Efficiency Controller for Boost, SEPIC and Flyback; MF: Texas Instruments; MP: LM3481MM/NOPB; SnapEDA_Link: https://www.snapeda.com/parts/LM3481MM/NOPB/Texas+Instruments/view-part/?ref=snap; Package: VSSOP-10 Texas Instruments; Value: *; Check_prices: https://www.snapeda.com/parts/LM3481MM/NOPB/Texas+Instruments/view-part/?ref=eda

## Nets that join several sheets
3V3: input_output (J1.3), logic (18 pins)
DGND: cd_switching (6 pins), input_output (5 pins), logic (26 pins)
PGND: cd_switching (14 pins), input_output (NT1.1 NT2.1 NT3.1 NT4.1), HV_power (30 pins)
ADC_SENSOR_1: input_output (J2.7), logic (R35.1)
EXT_SENSOR1_I2C_SCL: input_output (J2.5), logic (R38.2 U9.42)
EXT_SENSOR1_I2C_SDA: input_output (J2.6), logic (R36.2 U9.43)
FLYBACK_EN_L: cd_switching (Q3.3), HV_power (D10.1 R47.2 U5.2)
FLYBACK_EN_R: cd_switching (Q4.3), HV_power (D13.1 R60.2 U6.2)
IGNT_TRIG_L: cd_switching (U1.6), logic (U9.12)
IGNT_TRIG_R: cd_switching (U2.6), logic (U9.32)
KILL_SWITCH: input_output (J2.13), logic (C28.1 R42.1 U9.28)
L_COIL: cd_switching (C1.1), input_output (J2.1)
L_HV: cd_switching (C1.2 D2.1 Q1.2), HV_power (C38.2 D9.C R44.2 R45.2)
NetD11_1: logic (U9.45), HV_power (D11.1 R51.1 R54.2)
NetD14_1: logic (U9.46), HV_power (D14.1 R64.1 R67.2)
NRST: input_output (J1.12), logic (C29.1 R43.1 U9.7)
R_COIL: cd_switching (C6.1), input_output (J2.9)
R_HV: cd_switching (C6.2 D4.1 Q2.2), HV_power (C44.2 D12.C R57.2 R58.2)
SWCLK: input_output (J1.6), logic (U9.37)
SWDIO: input_output (J1.4), logic (U9.34)
UART_DEBUG_RX: input_output (J1.13 J2.18), logic (U9.31)
UART_DEBUG_TX: input_output (J1.14 J2.10), logic (U9.30)
VBAT: cd_switching (8 pins), input_output (7 pins), HV_power (14 pins)